# EAGLE design CycleOpsPro300toANTPlus_V1.0 (EAGLE 7.5.0)
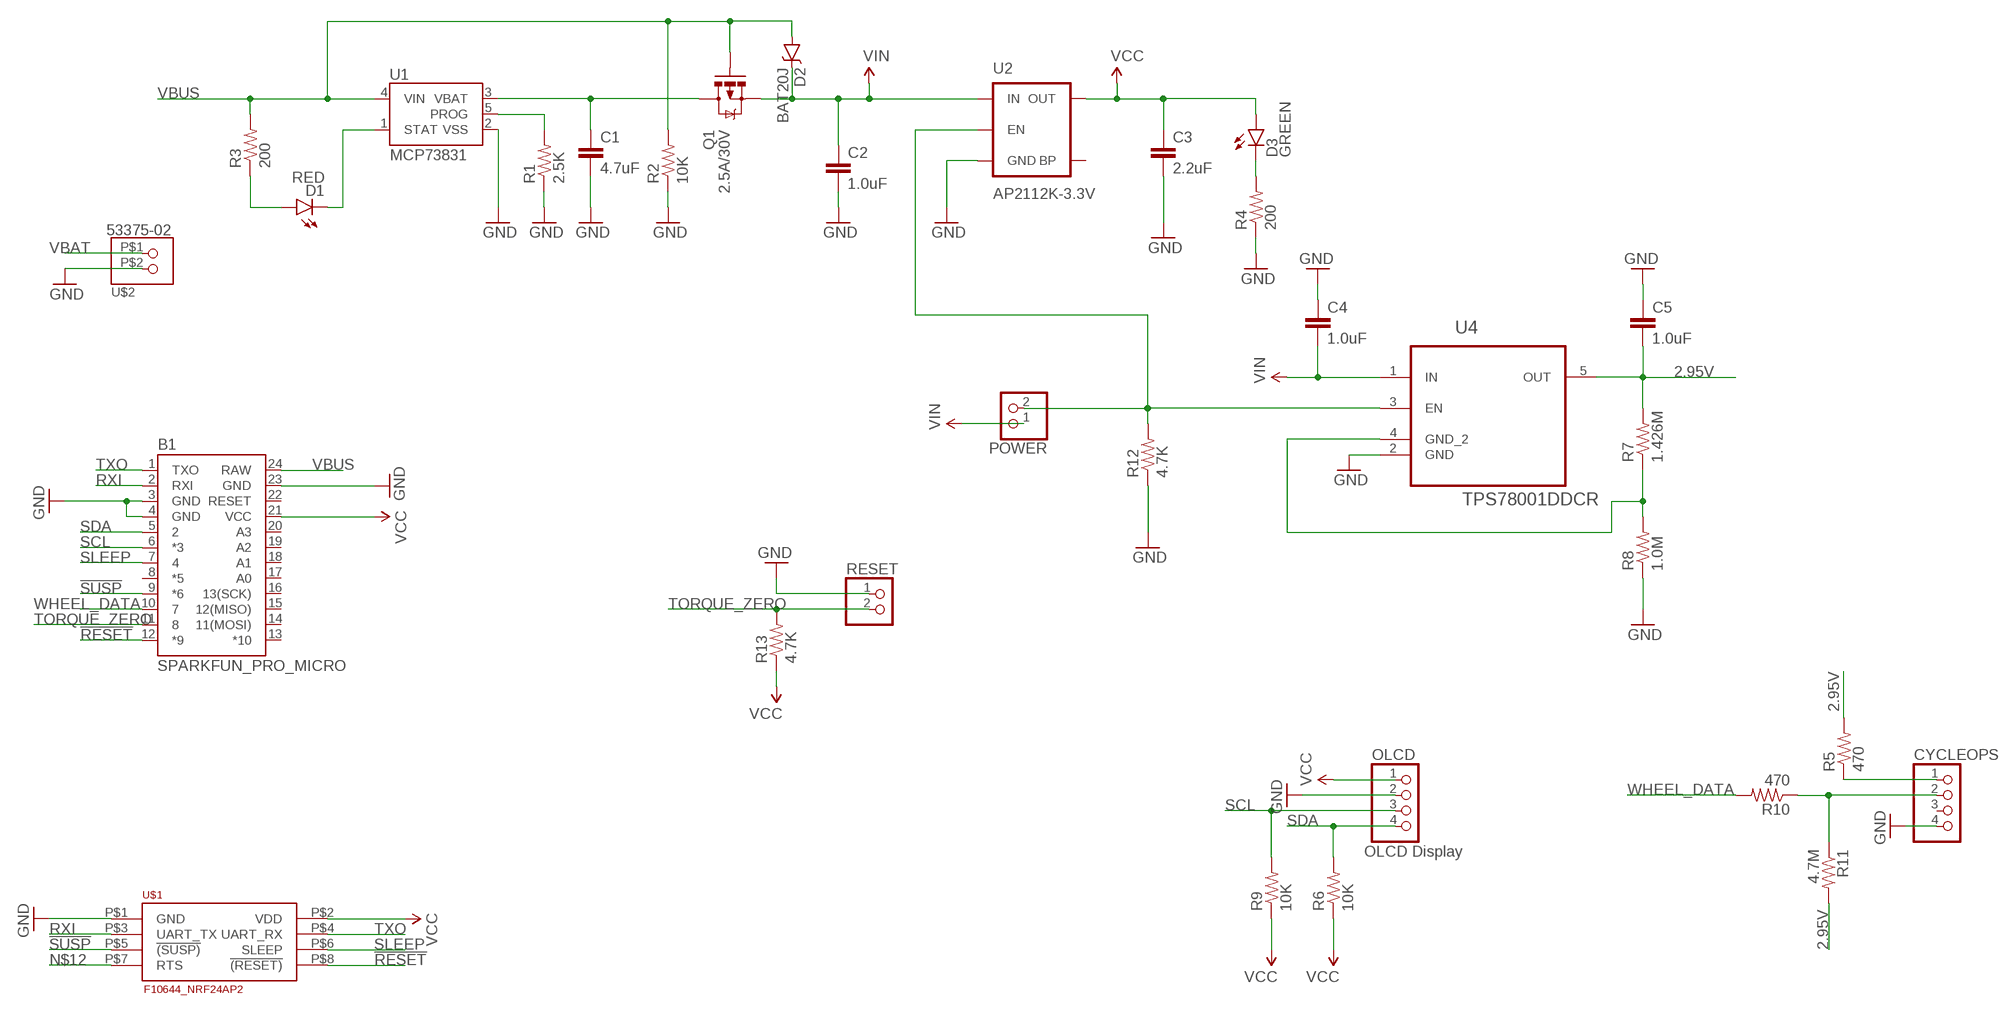
[diagram p0: schematic, sheet 1]

## Parts
B1  SPARKFUN_PRO_MICRO  [SPARKFUN_PRO_MICRO]
C1  4.7uF  CAP0603-CAP  [0603-CAP]
C2  1.0uF  CAP0603-CAP  [0603-CAP]
C3  2.2uF  CAP0603-CAP  [0603-CAP]
C4  1.0uF  CAP0603-CAP  [0603-CAP]
C5  1.0uF  CAP0603-CAP  [0603-CAP]
CYCLEOPS  PINHD-1X4  [1X04]
D1  RED  LED0603  [LED-0603]
D2  BAT20J  DIODE-SCHOTTKY-BAT20J  [SOD-323]
D3  GREEN  LED0603  [LED-0603]
OLCD  PINHD-1X4  [1X04]
POWER  PINHD-1X2  [1X02]
Q1  2.5A/30V  MOSFET-PCHANNELDMG2307L  [SOT23-3]
R1  2.5K  RESISTOR0603-RES  [0603-RES]
R2  10K  RESISTOR0603-RES  [0603-RES]
R3  200  RESISTOR0603-RES  [0603-RES]
R4  200  RESISTOR0603-RES  [0603-RES]
R5  470  RESISTOR0603-RES  [0603-RES]
R6  10K  RESISTOR0603-RES  [0603-RES]
R7  1.426M  RESISTOR0603-RES  [0603-RES]
R8  1.0M  RESISTOR0603-RES  [0603-RES]
R9  10K  RESISTOR0603-RES  [0603-RES]
R10  470  RESISTOR0603-RES  [0603-RES]
R11  4.7M  RESISTOR0603-RES  [0603-RES]
R12  4.7K  RESISTOR0603-RES  [0603-RES]
R13  4.7K  RESISTOR0603-RES  [0603-RES]
RESET  PINHD-1X2  [1X02]
U1  MCP73831  [SOT23-5]
U2  AP2112K-3.3V  V_REG_LDOSMD  [SOT23-5]
U4  TPS78001DDCR  TPS78223DDCR  [SOT95P280X110-5N]
U$1  F10644_NRF24AP2  [F10644_NRF24AP2]
U$2  53375-02  [53375-02]

## Nets
2.95V: C5.2 R5.2 R7.2 R11.2 U4.5(OUT)
!RESET: B1.12(*9) U$1.P$8(!(RESET))
!SUSP: B1.9(*6) U$1.P$5(!(SUSP))
GND: B1.3(GND) B1.4(GND) B1.23(GND) C1.2 C2.2 C3.2 C4.1 C5.1 CYCLEOPS.4 OLCD.2 R1.1 R2.1 R4.1 R8.1 R12.1 RESET.1 U1.2(VSS) U2.2(GND) U4.2(GND) U$1.P$1(GND) U$2.P$2
N$1: D1.A R3.1
N$2: D1.C U1.1(STAT)
N$3: CYCLEOPS.1 R5.1
N$4: R1.2 U1.5(PROG)
N$5: CYCLEOPS.2 R10.1 R11.1
N$6: D3.C R4.2
N$8: POWER.2 R12.2 U2.3(EN) U4.3(EN)
N$9: R7.1 R8.2 U4.4(GND_2)
N$12: U$1.P$7(RTS)
RXI: B1.2(RXI) U$1.P$3(UART_TX)
SCL: B1.6(*3) OLCD.3 R9.2
SDA: B1.5 OLCD.4 R6.2
SLEEP: B1.7 U$1.P$6(SLEEP)
TORQUE_ZERO: B1.11 R13.2 RESET.2
TXO: B1.1(TXO) U$1.P$4(UART_RX)
VBAT: C1.1 Q1.3(D) U1.3(VBAT) U$2.P$1
VBUS: B1.24(RAW) D2.A Q1.1(G) R2.2 R3.2 U1.4(VIN)
VCC: B1.21(VCC) C3.1 D3.A OLCD.1 R6.1 R9.1 R13.1 U2.5(OUT) U$1.P$2(VDD)
VIN: C2.1 C4.2 D2.C POWER.1 Q1.2(S) U2.1(IN) U4.1(IN)
WHEEL_DATA: B1.10 R10.2
Unconnected: B1.8(*5) B1.13(*10) B1.14(11(MOSI)) B1.15(12(MISO)) B1.16(13(SCK)) B1.17(A0) B1.18(A1) B1.19(A2) B1.20(A3) B1.22(RESET) CYCLEOPS.3 U2.4(BP)

## Notes on the sheet
- OLCD Display

## Library data of the parts
B1 = SparkFun-Boards:SPARKFUN_PRO_MICRO: SparkFun Pro Micro Atmega32U4 compatible footprint. SparkFun Products: 3.3V/8MHz <https://www.sparkfun.com/products/12587> 5V/16MHz <https://www.sparkfun.com/products/12640>
C1-C5 = SparkFun-Passives:CAP: Capacitor Standard 0603 ceramic capacitor, and 0.1" leaded capacitor.
CYCLEOPS OLCD = pinhead:PINHD-1X4: PIN HEADER
D1 D3 = SparkFun-LED:LED: LEDs Standard schematic elements and footprints for 5mm, 3mm, 1206, and 0603 sized LEDs. 5mm - Spark Fun Electronics SKU : COM-00529 (and others)
D2 = SparkFun-DiscreteSemi:DIODE-SCHOTTKY: Schottky diodes in SFE's production catalog BAT20J 1A 23V 0.62Vf RB751 120mA 40V 0.37Vf PMEG4005EJ 0.5A 40V 0.42Vf MBRA140 1A 40V 0.5Vf B340A 3A 40V SMA; PROD_ID: DIO-11623
POWER RESET = pinhead:PINHD-1X2: PIN HEADER
Q1 = SparkFun-DiscreteSemi:MOSFET-PCHANNEL: Generic PMOSFET IRLML2244 - TRANS-11153 (SOT-23 -20V -4.3A) (1.Gate 2.Source 3.Drain) FQP27P06 - COM-10349 <http://www.sparkfun.com/products/10349> (TO-220 -60V -27A) (1.Gate 2.Source 3.Drain); PROD_ID: TRANS-11308
R1-R13 = SparkFun-Passives:RESISTOR: Resistor Basic schematic elements and footprints for 0603, 1206, and PTH resistors.
U1 = SparkFun-PowerIC:MCP73831: Miniature single cell, fully integrated Li-Ion, Li-polymer charge management controller http://ww1.microchip.com/downloads/en/DeviceDoc/20001984g.pdf IC-09995; PROD_ID: IC-09995
U2 = SparkFun-PowerIC:V_REG_LDO: Voltage Regulator LDO Standard 150mA LDO voltage regulator in SOT-23 layout. Micrel part MIC5205. BP (by-pass) pin is used to lower output noise with 470pF cap.; PROD_ID: AP2112K-3.3V
U4 = Texas Instruments_By_element14_Batch_1:TPS78223DDCR: Low-Dropout Linear Regulator; MPN: TPS78223DDCR; OC_FARNELL: -; OC_NEWARK: 45P8304; PACKAGE: TSOT-23-5; SUPPLIER: Texas Instruments
U$1 = Networking and WiFI:F10644_NRF24AP2
U$2 = Molex_Connectors:53375-02: Mouser# 538-53375-0210

## Board
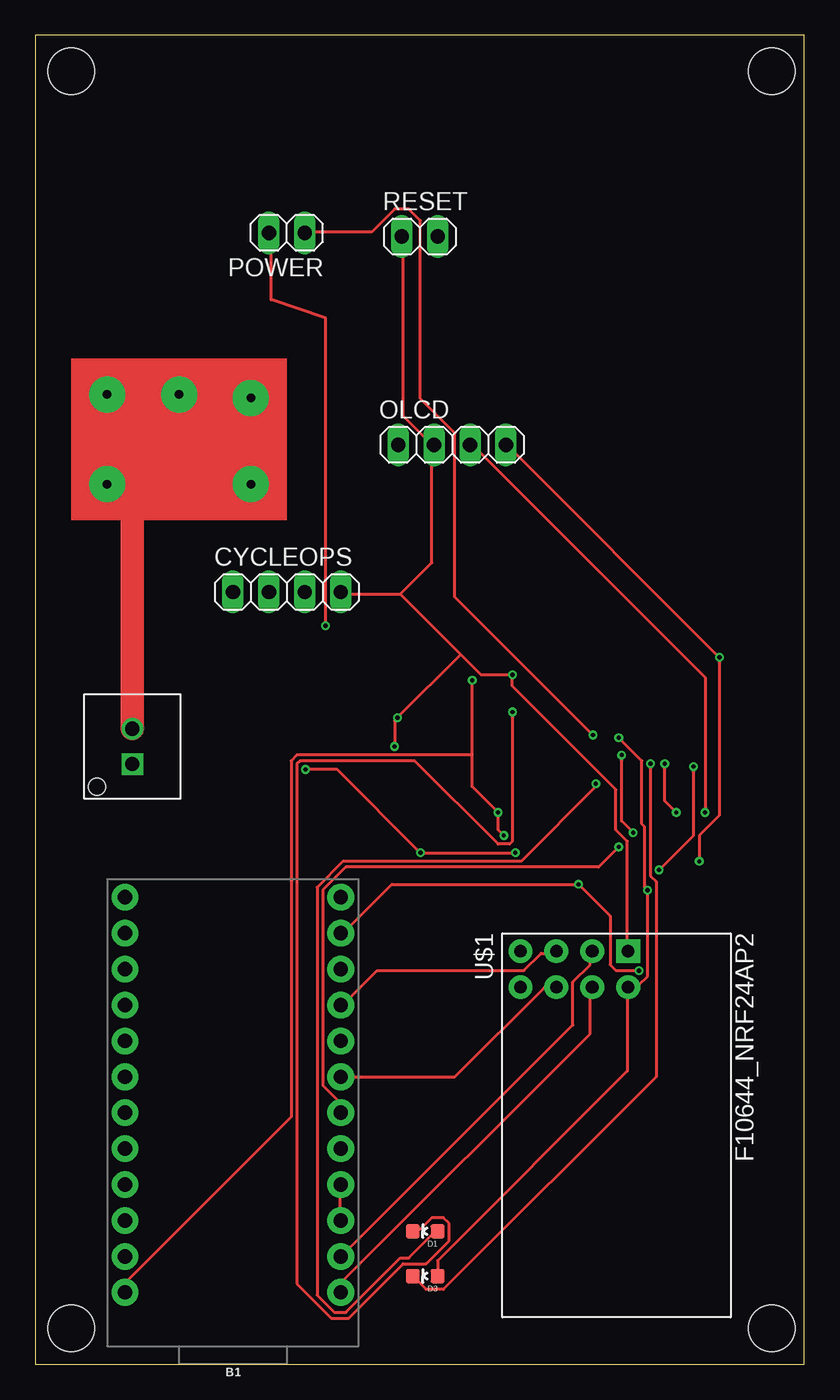
[diagram p1: board, top side]
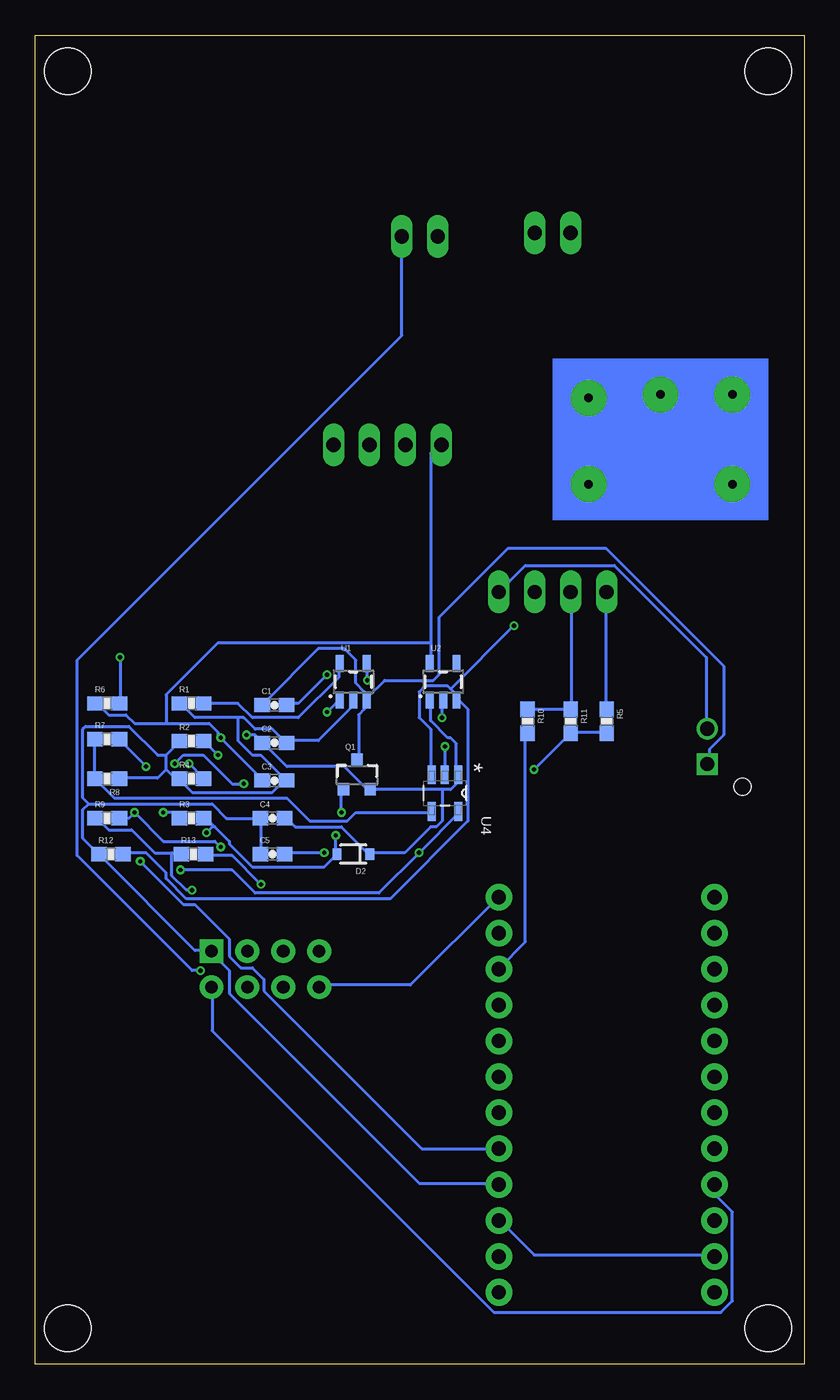
[diagram p2: board, bottom side, seen from below]

Size 54.36 x 93.98 mm. Coordinates in mm from the lower left corner, seen from the top.
Outline: 0,0 54.36,0 54.36,93.98 0,93.98 0,0
Copper layers (1*16): Top 0.035mm / dielectric 1.5mm / Bottom 0.035mm
Design rules "SeeedStudio_2layer_DRU_no_angle_20140221 *": minimum track width 8mil, minimum drill 12mil, track to track 8mil, track to pad 8mil, pad to pad 8mil, via to via 8mil, smd to smd 0mil, copper to edge 10mil, drill to drill 10mil, minimum pad ring 10mil, minimum via ring 6mil, stop-mask expansion 2mil, vias tented up to drill 100mil, thermal gap 10mil
Holes 3.3 mm at 2.54,2.54 52.07,2.54 52.07,91.44 2.54,91.44

### Footprints (pad centres in the part's own frame; a part is rotated, then mirrored left to right if it is on the bottom)
SPARKFUN_PRO_MICRO = drill 1.016 pad 1.88: 1 -7.62,12.7; 2 -7.62,10.16; 3 -7.62,7.62; 4 -7.62,5.08; 5 -7.62,2.54; 6 -7.62,0; 7 -7.62,-2.54; 8 -7.62,-5.08; 9 -7.62,-7.62; 10 -7.62,-10.16; 11 -7.62,-12.7; 12 -7.62,-15.24; 13 7.62,-15.24; 14 7.62,-12.7; 15 7.62,-10.16; 16 7.62,-7.62; 17 7.62,-5.08; 18 7.62,-2.54; 19 7.62,0; 20 7.62,2.54; 21 7.62,5.08; 22 7.62,7.62; 23 7.62,10.16; 24 7.62,12.7
0603-CAP = smd 1.1 x 1: 1 -0.85,0; 2 0.85,0
1X04 = drill 1.016 long: 1 -3.81,0; 2 -1.27,0; 3 1.27,0; 4 3.81,0
LED-0603 = smd 1 x 1: A 0,-0.877; C 0,0.877
SOD-323 = smd 0.63 x 0.83: A 1.15,0; C -1.15,0
1X02 = drill 1.016 long: 1 -1.27,0; 2 1.27,0
SOT23-3 = smd 0.8 x 0.9: 1 -0.95,-1; 2 0.95,-1; 3 0,1.1
0603-RES = smd 1.1 x 1: 1 -0.85,0; 2 0.85,0
SOT23-5 = smd 0.55 x 1.2: 1 -0.95,-1.3; 2 0,-1.3; 3 0.95,-1.3; 4 0.95,1.3; 5 -0.95,1.3
SOT95P280X110-5N = smd 1.321 x 0.559: 1 -1.295,0.94; 2 -1.295,0; 3 -1.295,-0.94; 4 1.295,-0.94; 5 1.295,0.94
F10644_NRF24AP2 = drill 0.889 pad 1.676 square: P$1 -1.27,3.81 | drill 0.889 pad 1.676: P$2 1.27,3.81; P$3 -1.27,1.27; P$4 1.27,1.27; P$5 -1.27,-1.27; P$6 1.27,-1.27; P$7 -1.27,-3.81; P$8 1.27,-3.81
53375-02 = drill 1 square: P$1 1.25,0 | drill 1: P$2 -1.25,0 | hole 1.2: 2.85,-2.5

### Placement (x,y rotation side)
B1  13.97,17.78 180 top
C1  37.47,46.61 0 bottom
C2  37.47,43.94 0 bottom
C3  37.47,41.27 0 bottom
C4  37.59,38.61 0 bottom
C5  37.59,36.07 0 bottom
CYCLEOPS  17.78,54.61 0 top
D1  27.56,9.4 90 top
D2  31.88,36.07 180 bottom
D3  27.56,6.22 90 top
OLCD  29.46,65.02 0 top
POWER  17.78,80.01 180 top
Q1  31.62,41.66 0 bottom
R1  43.31,46.74 0 bottom
R2  10.0K  [0603-RES]  43.31,44.07 0 bottom
R3  43.31,38.61 0 bottom
R4  43.31,41.4 0 bottom
R5  13.97,45.47 270 bottom
R6  49.28,46.74 0 bottom
R7  49.28,44.2 0 bottom
R8  49.28,41.4 180 bottom
R9  49.28,38.61 0 bottom
R10  19.56,45.47 270 bottom
R11  16.51,45.47 270 bottom
R12  49.02,36.07 0 bottom
R13  43.18,36.07 0 bottom
RESET  27.18,79.76 0 top
U1  31.88,48.26 0 bottom
U2  25.53,48.26 0 bottom
U4  TPS78223DDCR  [SOT95P280X110-5N]  25.4,40.39 270 bottom
U$1  38.1,27.94 270 top
U$2  6.86,43.69 270 top

### Tracks (layer width: path | path; a pad name or v marks a point on that pad's centre or on a via)
2.95V  (via drill 0.3)
  Top 0.203: v33.93,36.17 v27.23,36.17 21.34,42.06 v19.1,42.06 | v46.53,42.27 46.53,37.39 v44.09,34.95
  Bottom 0.203: R5.2 14.02,44.7 16.46,44.7 R11.2 16.66,44.5 v19.1,42.06 | v33.93,36.17 36.58,36.17 C5.2 | U4.5 24.38,39.01 v27.23,36.17 30.07,33.33 38.81,33.33 40.44,34.95 v44.09,34.95 | v46.53,42.27 48.36,44.09 R7.2
!RESET
  Bottom 0.203: U$1.P$8 34.14,26.82 27.84,26.82 21.74,32.92 B1.12
!SUSP
  Top 0.203: U$1.P$5 36.78,29.06 35.76,29.06 34.54,27.84 24.18,27.84 21.74,25.4 B1.9
GND  (via drill 0.3)
  Top 0.203: 25.81,54.46 30.07,50.19 | 30.07,50.19 31.5,48.77 v33.73,48.77 33.73,47.95 41.05,40.64 41.05,37.8 41.86,36.98 41.86,29.26 U$1.P$1 | 25.81,54.46 21.74,54.46 CYCLEOPS.4 | 30.07,50.19 v25.6,45.72 25.4,45.52 v25.4,43.69 | 28.04,65.02 28.04,56.69 25.81,54.46 | 28.04,65.02 26.01,67.06 26.01,79.65 RESET.1 | 28.04,65.02 OLCD.2 | B1.4 21.54,12.6 21.54,10.16 B1.3
  Bottom 0.203: v33.73,48.77 35.76,46.74 36.58,46.74 C1.2 | v25.6,45.72 25.6,46.94 U2.2 | v25.4,43.69 U4.2 | CYCLEOPS.4 19.71,56.49 13.41,56.49 6.91,49.99 6.91,45.11 U$2.P$2 | B1.23 6.5,7.72 19.1,7.72 21.54,10.16 B1.3 | 45.11,43.08 44.3,43.89 R2.1 | 45.11,42.06 45.11,43.08 | 45.11,42.06 44.3,41.25 R4.1 44.09,41.25 43.28,40.44 37.59,40.44 36.78,41.25 C3.2 36.78,41.45 38.41,43.08 39.01,43.08 40.03,44.09 40.03,45.72 | 45.11,42.06 45.72,41.45 48.36,41.45 R8.1 | U1.2 31.9,46.94 31.9,46.53 34.34,44.09 36.58,44.09 C2.2 36.78,44.09 37.59,44.91 38.81,44.91 39.62,45.72 40.03,45.72 | 40.03,45.72 43.08,45.72 44.09,46.74 R1.1 | C5.1 38.41,36.17 38.41,38.61 C4.1 40.84,38.61 41.86,39.62 50.6,39.62 | 50.6,39.62 51,39.22 51,37.19 49.99,36.17 R12.1 49.78,35.97 43.08,29.26 42.06,29.26 U$1.P$1 41.86,29.06 40.64,27.84 40.64,26.21 27.23,12.8 21.74,12.8 B1.4 | 45.11,43.08 45.72,43.08 47.75,45.11 50.8,45.11 51,44.91 51,40.03 50.6,39.62
N$1  (via drill 0.3)
  Top 0.203: v39.62,41.05 39.62,40.84 34.34,35.56 21.74,35.56 19.91,33.73 19.91,4.88 21.13,3.66 21.95,3.66 25.81,7.52 26.42,7.52 28.25,9.35 D1.A | v44.5,42.47 44.5,39.83 v45.31,39.01
  Bottom 0.203: v39.62,41.05 40.44,41.05 42.47,43.08 43.89,43.08 v44.5,42.47 | v45.31,39.01 44.7,39.01 44.3,38.61 R3.1
N$2  (via drill 0.3)
  Top 0.203: v33.73,46.13 33.73,36.98 33.53,36.78 32.72,36.78 26.82,42.67 18.69,42.67 18.49,42.47 18.49,5.69 20.93,3.25 22.15,3.25 26.01,7.11 27.64,7.11 29.26,8.74 29.26,9.96 28.85,10.36 28.04,10.36 27.23,9.55 26.82,9.55 D1.C
  Bottom 0.203: v33.73,46.13 32.92,46.94 U1.1
N$3
  Bottom 0.203: R5.1 14.02,46.33 14.02,54.46 CYCLEOPS.1
N$4
  Bottom 0.203: R1.2 40.03,46.74 39.01,45.72 35.76,45.72 32.92,48.56 32.92,49.38 U1.5
N$5
  Bottom 0.203: R10.1 19.51,46.33 16.66,46.33 R11.1 16.46,46.33 16.46,54.46 CYCLEOPS.2
N$6  (via drill 0.3)
  Top 0.203: v43.48,42.47 43.48,34.54 43.89,34.14 43.89,20.32 28.85,5.28 27.64,5.28 26.82,6.1 D3.C
  Bottom 0.203: v43.48,42.47 42.47,41.45 R4.2
N$7
  Top 1.676: 6.86,44.96 6.86,61.47
N$8  (via drill 0.3)
  Top 0.203: v20.52,52.22 20.52,73.97 16.66,75.29 16.66,79.86 POWER.2
  Bottom 0.203: R12.2 48.16,36.17 46.53,36.17 45.11,34.75 45.11,34.34 43.69,32.92 29.26,32.92 23.77,38.41 23.77,46.33 24.38,46.94 U2.3 24.38,47.14 24.99,47.75 | 24.99,47.75 25.2,47.95 26.82,47.95 27.23,47.55 27.23,45.72 26.42,44.91 26.42,41.86 U4.3 | 24.99,47.75 v20.52,52.22
N$9
  Bottom 0.203: R7.1 50.19,44.09 50.19,41.45 R8.2 49.99,41.25 48.77,40.03 36.58,40.03 34.95,38.41 32.31,38.41 31.7,39.01 26.42,39.01 U4.4
N$10  (via drill 0.6 pad 2.54)
  other vias: 5.08,68.58
N$11  (via drill 0.6 pad 2.54)
  other vias: 15.24,68.33
N$13  (via drill 0.6 pad 2.54)
  other vias: 15.24,62.23
N$14  (via drill 0.6 pad 2.54)
  other vias: 5.08,62.23
N$15  (via drill 0.6 pad 2.54)
  other vias: 10.16,68.58
RXI
  Top 0.203: U$1.P$3 39.22,29.06 39.22,28.25 38,27.03 38,23.98 21.74,7.72 B1.2
SCL  (via drill 0.3)
  Top 0.203: v47.35,39.01 47.35,48.56 30.89,65.02 OLCD.3 | v41.25,36.58 39.83,35.15 21.95,35.15 20.32,33.53 20.32,19.71 21.54,18.49 21.54,17.88 B1.6
  Bottom 0.203: R9.2 47.75,38.61 v47.35,39.01 45.31,36.98 41.66,36.98 v41.25,36.58
SDA  (via drill 0.3)
  Top 0.203: OLCD.4 33.33,65.02 v48.36,49.99 48.36,38.81 46.94,37.39 v46.94,35.56
  Bottom 0.203: v48.36,49.99 48.36,46.74 R6.2 | B1.5 27.03,15.24 38.2,26.42 38.2,27.23 39.01,28.04 39.83,28.04 40.64,28.85 40.64,30.07 43.08,32.51 43.89,32.51 v46.94,35.56
SLEEP
  Top 0.203: B1.7 29.67,20.32 35.97,26.62 36.78,26.62 U$1.P$6
TORQUE_ZERO  (via drill 0.3)
  Top 0.203: B1.11 21.74,30.48 25.2,33.93 v38.41,33.93 40.64,31.7 40.64,28.25 41.05,27.84 v42.67,27.84
  Bottom 0.203: v38.41,33.93 40.44,35.97 42.27,35.97 R13.2 | RESET.2 28.45,72.75 51.41,49.78 51.41,35.97 43.28,27.84 v42.67,27.84
TXO
  Top 0.203: U$1.P$4 39.22,26.62 39.22,23.37 21.74,5.89 21.74,5.08 B1.1
VBAT
  Bottom 0.203: Q1.3 31.5,42.88 31.5,45.92 31.09,46.33 31.09,46.94 U1.3 | C1.1 38.2,46.74 34.34,50.6 32.51,50.6 31.7,49.78 31.7,48.16 31.09,47.55 31.09,47.14 U1.3 | U$2.P$1 6.71,42.47 6.71,43.48 5.69,44.5 5.69,49.38 14.02,57.71 20.93,57.71 25.81,52.83 25.81,48.77 26.21,48.36 29.67,48.36 30.89,47.14 U1.3
VBUS  (via drill 0.3)
  Top 0.203: v33.12,37.39 32.72,37.8 v32.72,39.01 30.89,40.84 30.89,43.08 | v41.45,43.08 41.45,38.41 v42.27,37.59 | 30.89,43.08 v30.89,48.36 | 30.89,43.08 18.49,43.08 18.09,42.67 18.09,17.48 6.5,5.89 6.5,5.08 B1.24
  Bottom 0.203: 41.66,38 42.27,38.61 R3.2 | 41.66,38 40.64,36.98 40.64,36.78 39.01,35.15 33.93,35.15 33.12,35.97 D2.A 33.12,36.17 v33.12,37.39 | v32.72,39.01 32.72,40.64 Q1.1 | v41.45,43.08 42.27,43.89 R2.2 | v42.27,37.59 41.86,38 41.66,38 | v30.89,48.36 30.89,49.38 U1.4
VCC  (via drill 0.3)
  Top 0.203: D3.A 28.45,6.3 28.45,7.32 41.86,20.73 41.86,26.62 U$1.P$2 42.06,26.82 42.67,26.82 43.28,27.43 v43.28,33.53 43.08,33.73 43.08,38 42.88,38.2 42.88,42.67 v41.25,44.3
  Bottom 0.203: 45.11,45.31 47.35,45.31 47.95,45.92 49.17,45.92 49.99,46.74 R6.1 | 45.11,45.31 42.06,45.31 41.45,44.7 41.45,44.5 v41.25,44.3 38.41,41.45 C3.1 | 26.42,51 26.42,64.41 25.81,65.02 OLCD.1 | 26.42,51 26.42,49.58 U2.5 | 45.11,45.31 45.11,47.35 41.45,51 26.42,51 | 44.7,36.17 45.92,36.17 47.55,37.8 49.17,37.8 49.99,38.61 R9.1 | 44.7,36.17 44.09,36.17 R13.1 | B1.21 6.3,12.6 6.3,11.99 5.08,10.77 5.08,4.47 5.89,3.66 21.95,3.66 41.86,23.57 41.86,26.62 U$1.P$2 | 44.7,36.17 44.7,34.54 43.69,33.53 v43.28,33.53
VIN  (via drill 0.3)
  Top 0.203: v39.42,44.5 29.67,54.25 29.67,65.84 27.23,68.28 27.23,80.87 26.42,81.69 25.4,81.69 23.77,80.06 19.1,80.06 POWER.1
  Bottom 0.203: C4.2 36.58,38.61 35.97,38 32.72,38 30.89,36.17 D2.C 30.68,36.17 28.25,36.17 26.42,38 26.01,38 25.6,38.41 25.6,40.64 | 25.6,40.64 24.99,40.64 24.59,41.05 24.59,41.66 U4.1 24.59,41.86 24.59,43.89 24.99,44.3 25.2,44.3 26.42,45.52 26.42,46.94 U2.1 | 25.6,40.64 30.48,40.64 Q1.2 30.68,40.84 31.09,40.84 32.51,42.27 36.58,42.27 38.2,43.89 C2.1 38.41,44.09 38.81,44.5 v39.42,44.5
WHEEL_DATA
  Bottom 0.203: R10.2 19.71,44.5 19.71,29.87 21.54,28.04 B1.10
(copper drawn outside any net)
  shapes: Bottom area x1, Top area x1

### Text on the board
tDocu: CYCLEOPS PRO 300PT TO ANT+ | V1.0 2017-02 | GND | SCL | VCC | GND | SDA | GND | 2.95V | GND | BAT+ | WHEEL_DATA